# Altium schematic sheet Header_and_OnboardConponents.SchDoc
size B; SheetNumber: 4; SheetTotal: 6
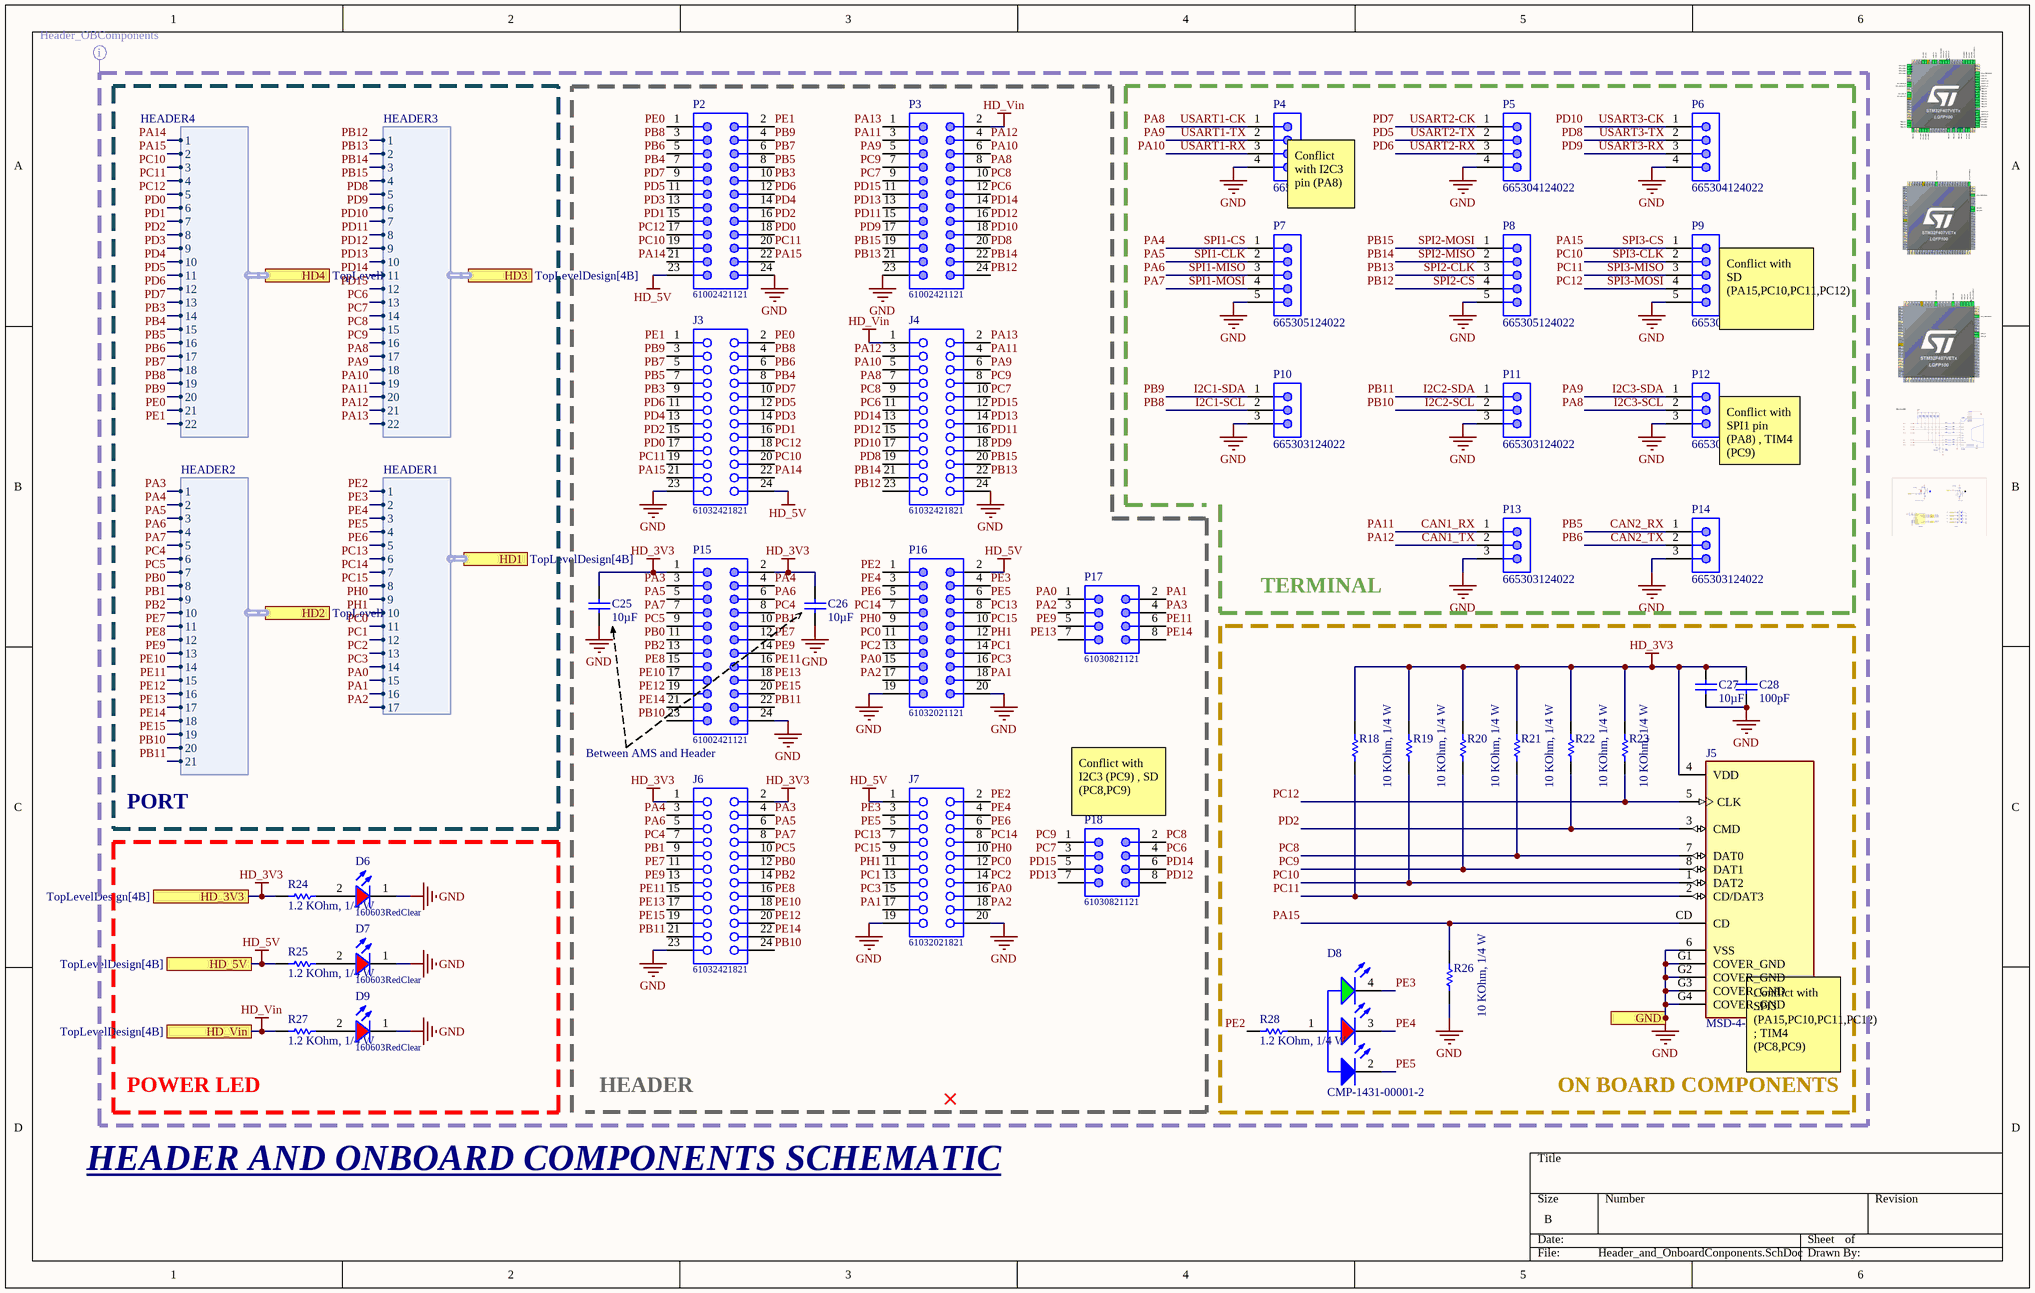
[diagram p0: Header_and_OnboardConponents.SchDoc]

## Parts
C25  value 10µF  [CAP_0603]  (hidden comment: 0106031061010)
C26  value 10µF  [CAP_0603]  (hidden comment: 0106031061010)
C27  value 10µF  [CAP_0603]  (hidden comment: 0106031061010)
C28  value 100pF  [CAP_0603]  (hidden comment: 0106031010550)
D6  160603RedClear  [WL-SMCW_0603_H=0.7mm]
D7  160603RedClear  [WL-SMCW_0603_H=0.7mm]
D8  CMP-1431-00001-2  [WL-SFTW_3528_150141M173100]
D9  160603RedClear  [WL-SMCW_0603_H=0.7mm]
J3  61032421821  [61032421821]
J4  61032421821  [61032421821]
J5  MSD-4-A  [CUI_MSD-4-A]
J6  61032421821  [61032421821]
J7  61032021821  [61032021821]
P2  61002421121  [61002421121]
P3  61002421121  [61002421121]
P4  665304124022  [665304124022]
P5  665304124022  [665304124022]
P6  665304124022  [665304124022]
P7  665305124022  [665305124022]
P8  665305124022  [665305124022]
P9  665305124022  [665305124022]
P10  665303124022  [665303124022]
P11  665303124022  [665303124022]
P12  665303124022  [665303124022]
P13  665303124022  [665303124022]
P14  665303124022  [665303124022]
P15  61002421121  [61002421121]
P16  61032021121  [61032021121]
P17  61030821121  [61030821121]
P18  61030821121  [61030821121]
R18  value 10 KOhm, 1/4 W  [resistor_0603]  (hidden comment: 0006031031)
R19  value 10 KOhm, 1/4 W  [resistor_0603]  (hidden comment: 0006031031)
R20  value 10 KOhm, 1/4 W  [resistor_0603]  (hidden comment: 0006031031)
R21  value 10 KOhm, 1/4 W  [resistor_0603]  (hidden comment: 0006031031)
R22  value 10 KOhm, 1/4 W  [resistor_0603]  (hidden comment: 0006031031)
R23  value 10 KOhm, 1/4 W  [resistor_0603]  (hidden comment: 0006031031)
R24  value 1.2 KOhm, 1/4 W  [resistor_0603]  (hidden comment: 0006031221)
R25  value 1.2 KOhm, 1/4 W  [resistor_0603]  (hidden comment: 0006031221)
R26  value 10 KOhm, 1/4 W  [resistor_0603]  (hidden comment: 0006031031)
R27  value 1.2 KOhm, 1/4 W  [resistor_0603]  (hidden comment: 0006031221)
R28  value 1.2 KOhm, 1/4 W  [resistor_0603]  (hidden comment: 0006031221)

## Blocks framed on the sheet
ON BOARD COMPONENTS: C27 C28 D8 J5 R18-R23 R26 R28
POWER LED: D6 D7 D9 R24 R25 R27

## Ports
GND (see TopLevelDesign[4B], MainMCU[2B], Power[5C], ST-LinkV2[3B]), HD1 (harness HEADER1, see TopLevelDesign[4B]), HD2 (harness HEADER2, see TopLevelDesign[4B]), HD3 (harness HEADER3, see TopLevelDesign[4B]), HD4 (harness HEADER4, see TopLevelDesign[4B]), HD_3V3 (see TopLevelDesign[4B]), HD_5V (see TopLevelDesign[4B]), HD_Vin (see TopLevelDesign[4B])

## Harnesses
HEADER2: 1, 2, 3, 4, 5, 6, 7, 8, 9, 10, 11, 12, 13, 14, 15, 16, 17, 18, 19, 20, 21
HEADER3: 1, 2, 3, 4, 5, 6, 7, 8, 9, 10, 11, 12, 13, 14, 15, 16, 17, 18, 19, 20, 21, 22
HEADER4: 1, 2, 3, 4, 5, 6, 7, 8, 9, 10, 11, 12, 13, 14, 15, 16, 17, 18, 19, 20, 21, 22
HEADER1: 1, 2, 3, 4, 5, 6, 7, 8, 9, 10, 11, 12, 13, 14, 15, 16, 17

## Nets
GND: C25.1 C26.1 C27.1 C28.1 D6.1(K) D7.1(K) D9.1(K) J3.23 J4.24 J5.6(VSS) J5.G1(COVER_GND) J5.G2(COVER_GND) J5.G3(COVER_GND) J5.G4(COVER_GND) J6.23 J7.19 J7.20 P2.24 P3.23 P4.4 P5.4 P6.4 P7.5 P8.5 P9.5 P10.3 P11.3 P12.3 P13.3 P14.3 P15.24 P16.19 P16.20 R26.1 ; port GND
HD_3V3: C25.2 C26.2 C27.2 C28.2 J5.4(VDD) J6.1 J6.2 P15.1 P15.2 R18.2 R19.2 R20.2 R21.2 R22.2 R23.2 R24.2 ; port HD_3V3
HD_5V: J3.24 J7.1 P2.23 P16.2 R25.2 ; port HD_5V
HD_Vin: J4.1 P3.2 R27.2 ; port HD_Vin
CAN1_RX: J4.4 P3.3 P13.1 ; port HD3.20  [also labelled PA11]
CAN1_TX: J4.3 P3.4 P13.2 ; port HD3.21  [also labelled PA12]
CAN2_RX: J3.7 P2.8 P14.1 ; port HD4.16  [also labelled PB5]
CAN2_TX: J3.6 P2.5 P14.2 ; port HD4.17  [also labelled PB6]
I2C1-SCL: J3.4 P2.3 P10.2 ; port HD4.19  [also labelled PB8]
I2C1-SDA: J3.3 P2.4 P10.1 ; port HD4.20  [also labelled PB9]
I2C2-SCL: J6.24 P11.2 P15.23 ; port HD2.20  [also labelled PB10]
I2C2-SDA: J6.21 P11.1 P15.22 ; port HD2.21  [also labelled PB11]
I2C3-SCL: J4.7 P3.8 P4.1 P12.2 ; port HD3.17  [also labelled PA8, USART1-CK]
I2C3-SDA: J4.6 P3.5 P4.2 P12.1 ; port HD3.18  [also labelled PA9, USART1-TX]
PA0: J7.16 P16.15 P17.1 ; port HD1.15
PA1: J7.17 P16.18 P17.2 ; port HD1.16
PA2: J7.18 P16.17 P17.3 ; port HD1.17
PA3: J6.4 P15.3 P17.4 ; port HD2.1
PA4: J6.3 P7.1 P15.4 ; port HD2.2  [also labelled SPI1-CS]
PA5: J6.6 P7.2 P15.5 ; port HD2.3  [also labelled SPI1-CLK]
PA6: J6.5 P7.3 P15.6 ; port HD2.4  [also labelled SPI1-MISO]
PA7: J6.8 P7.4 P15.7 ; port HD2.5  [also labelled SPI1-MOSI]
PA10: J4.5 P3.6 P4.3 ; port HD3.19  [also labelled USART1-RX]
PA13: J4.2 P3.1 ; port HD3.22
PA14: J3.22 P2.21 ; port HD4.1
PA15: J3.21 J5.CD P2.22 P9.1 R26.2 ; port HD4.2  [also labelled SPI3-CS]
PB0: J6.12 P15.11 ; port HD2.8
PB1: J6.9 P15.10 ; port HD2.9
PB2: J6.14 P15.13 ; port HD2.10
PB3: J3.9 P2.10 ; port HD4.14
PB4: J3.8 P2.7 ; port HD4.15
PB7: J3.5 P2.6 ; port HD4.18
PB12: J4.23 P3.24 P8.4 ; port HD3.1  [also labelled SPI2-CS]
PB13: J4.22 P3.21 P8.3 ; port HD3.2  [also labelled SPI2-CLK]
PB14: J4.21 P3.22 P8.2 ; port HD3.3  [also labelled SPI2-MISO]
PB15: J4.20 P3.19 P8.1 ; port HD3.4  [also labelled SPI2-MOSI]
PC0: J7.12 P16.11 ; port HD1.11
PC1: J7.13 P16.14 ; port HD1.12
PC2: J7.14 P16.13 ; port HD1.13
PC3: J7.15 P16.16 ; port HD1.14
PC4: J6.7 P15.8 ; port HD2.6
PC5: J6.10 P15.9 ; port HD2.7
PC6: J4.11 P3.12 P18.4 ; port HD3.13
PC7: J4.10 P3.9 P18.3 ; port HD3.14
PC8: J4.9 J5.7(DAT0) P3.10 P18.2 R21.1 ; port HD3.15
PC9: J4.8 J5.8(DAT1) P3.7 P18.1 R20.1 ; port HD3.16
PC10: J3.20 J5.1(DAT2) P2.19 P9.2 R19.1 ; port HD4.3  [also labelled SPI3-CLK]
PC11: J3.19 J5.2(CD/DAT3) P2.20 P9.3 R18.1 ; port HD4.4  [also labelled SPI3-MISO]
PC12: J3.18 J5.5(CLK) P2.17 P9.4 R23.1 ; port HD4.5  [also labelled SPI3-MOSI]
PC13: J7.7 P16.8 ; port HD1.6
PC14: J7.8 P16.7 ; port HD1.7
PC15: J7.9 P16.10 ; port HD1.8
PD0: J3.17 P2.18 ; port HD4.6
PD1: J3.16 P2.15 ; port HD4.7
PD2: J3.15 J5.3(CMD) P2.16 R22.1 ; port HD4.8
PD3: J3.14 P2.13 ; port HD4.9
PD4: J3.13 P2.14 ; port HD4.10
PD5: J3.12 P2.11 P5.2 ; port HD4.11  [also labelled USART2-TX]
PD6: J3.11 P2.12 P5.3 ; port HD4.12  [also labelled USART2-RX]
PD7: J3.10 P2.9 P5.1 ; port HD4.13  [also labelled USART2-CK]
PD8: J4.19 P3.20 P6.2 ; port HD3.5  [also labelled USART3-TX]
PD9: J4.18 P3.17 P6.3 ; port HD3.6  [also labelled USART3-RX]
PD10: J4.17 P3.18 P6.1 ; port HD3.7  [also labelled USART3-CK]
PD11: J4.16 P3.15 ; port HD3.8
PD12: J4.15 P3.16 P18.8 ; port HD3.9
PD13: J4.14 P3.13 P18.7 ; port HD3.10
PD14: J4.13 P3.14 P18.6 ; port HD3.11
PD15: J4.12 P3.11 P18.5 ; port HD3.12
PE0: J3.2 P2.1 ; port HD4.21
PE1: J3.1 P2.2 ; port HD4.22
PE2: J7.2 P16.1 R28.1 ; port HD1.1
PE3: D8.4(K) J7.3 P16.4 ; port HD1.2
PE4: D8.3(K) J7.4 P16.3 ; port HD1.3
PE5: D8.2(K) J7.5 P16.6 ; port HD1.4
PE6: J7.6 P16.5 ; port HD1.5
PE7: J6.11 P15.12 ; port HD2.11
PE8: J6.16 P15.15 ; port HD2.12
PE9: J6.13 P15.14 P17.5 ; port HD2.13
PE10: J6.18 P15.17 ; port HD2.14
PE11: J6.15 P15.16 P17.6 ; port HD2.15
PE12: J6.20 P15.19 ; port HD2.16
PE13: J6.17 P15.18 P17.7 ; port HD2.17
PE14: J6.22 P15.21 P17.8 ; port HD2.18
PE15: J6.19 P15.20 ; port HD2.19
PH0: J7.10 P16.9 ; port HD1.9
PH1: J7.11 P16.12 ; port HD1.10
NetD6_2: D6.2(A) R24.1
NetD7_2: D7.2(A) R25.1
NetD8_1: D8.1(A) R28.2
NetD9_2: D9.2(A) R27.1

## Layout directives
mark named Header_OBComponents: CAN1_RX, CAN1_TX, CAN2_RX, CAN2_TX, GND, HD_3V3, HD_5V, HD_Vin, I2C1-SCL, I2C1-SDA, I2C2-SCL, I2C2-SDA, I2C3-SCL, I2C3-SDA, PA0, PA1, PA2, PA3, PA4, PA5, PA6, PA7, PA8, PA9, PA10, PA11, PA12, PA13, PA14, PA15, PB0, PB1, PB2, PB3, PB4, PB5, PB6, PB7, PB8, PB9, PB10, PB11, PB12, PB13, PB14, PB15, PC0, PC1, PC2, PC3, PC4, PC5, PC6, PC7, PC8, PC9, PC10, PC11, PC12, PC13, PC14, PC15, PD0, PD1, PD2, PD3, PD4, PD5, PD6, PD7, PD8, PD9, PD10, PD11, PD12, PD13, PD14, PD15, PE0, PE1, PE2, PE3, PE4, PE5, PE6, PE7, PE8, PE9, PE10, PE11, PE12, PE13, PE14, PE15, PH0, PH1, SPI1-CLK, SPI1-CS, SPI1-MISO, SPI1-MOSI, SPI2-CLK, SPI2-CS, SPI2-MISO, SPI2-MOSI, SPI3-CLK, SPI3-CS, SPI3-MISO, SPI3-MOSI, USART1-CK, USART1-RX, USART1-TX, USART2-CK, USART2-RX, USART2-TX, USART3-CK, USART3-RX, USART3-TX

## Notes on the sheet
- (near P4) Conflict with I2C3 pin (PA8)
- (near P9) Conflict with SD (PA15,PC10,PC11,PC12)
- (near P12) Conflict with SPI1 pin (PA8) , TIM4 (PC9)
- TERMINAL
- Between AMS and Header
- PORT
- (near P18) Conflict with I2C3 (PC9) , SD (PC8,PC9)
- HEADER
- (near J5) Conflict with SPI3 (PA15,PC10,PC11,PC12) ; TIM4 (PC8,PC9)
- HEADER AND ONBOARD COMPONENTS SCHEMATIC

## Library data of the parts
C25-C27 = CMP-001-00219-1: CAP, size 0603, 10 uF, 10 VDC; Manufacture Name: Samsung Electro-Mechanics; Manufacture SN: CL10A106KP8NNWC; Voltage Rating DC: 10 VDC; Tolerance: 10%; Supplier 3 Name: thegioiic; Supplier 2 Name: Digi-Key; Design Item ID: 0106031061010; Size: 0603; Packaging: Tape and Reel; Supplier 1 URL: https://www.mouser.vn/ProductDetail/Samsung-Electro-Mechanics/CL10A106KP8NNWC?qs=xZ%2FP%252Ba9zWqZx8LSX23YqWA%3D%3D&utm_source=mouser-refine-download&utm_medium=file&utm_campaign=CL10A106KP8NNWC&utm_content=Samsung-Electro-Mechanics; Supplier 3 SN: N/A; Component Type: Standard; Supplier 2 SN: 1276-CL10A106KP8NNWCTR-ND; Supplier 1 Name: Mouser; Supplier 2 URL: https://www.digikey.com/en/products/detail/samsung-electro-mechanics/cl10a106kp8nnwc/16572907; Source: Capacitor_0603_10_percent.SchLib; Supplier 3 URL: https://www.thegioiic.com/tu-gom-0603-10uf-25v; Pins: 2; Supplier 1 SN: 187-CL10A106KP8NNWC; Operating Temperature: -55 to +125degC; Mounting Technology: SMT
C28 = CMP-001-00209-1: CAP, size 0603, 100 pF, 50 VDC; Manufacture Name: TDK; Manufacture SN: CGA3E2C0G1H101J080AA; Voltage Rating DC: 50 VDC; Tolerance: 5%; Packaging: Tape and Reel; Supplier 3 SN: N/A; Source: Capacitor_0603_5_percent.SchLib; Supplier 1 URL: https://www.mouser.com/ProductDetail/TDK/CGA3E2C0G1H101J080AA?qs=FxQuwy19cyBF0gUakpLdHA%3D%3D&utm_source=mouser-refine-download&utm_medium=file&utm_campaign=CGA3E2C0G1H101J080AA&utm_content=TDK; Supplier 3 URL: N/A; Supplier 2 URL: https://www.digikey.com/en/products/detail/tdk-corporation/cga3e2c0g1h101j080aa/2443118; Supplier 2 Name: Digi-Key; Supplier 1 SN: 810-CGA3E2C0G1H101J; Mounting Technology: SMT; Size: 0603; Design Item ID: 0106031010550; Supplier 1 Name: Mouser; Component Type: Standard; Operating Temperature: -55 to +125degC; Supplier 3 Name: thegioiic; Pins: 2; Supplier 2 SN: 445-5640-2-ND
D6 D7 D9 = CMP-004-00094-1: WL-SMCW SMT Mono-color Chip LED Waterclear, size 0603, Red, 2V, 140deg; Type: Clear; Value: Red, 2V; ComponentLink4URL: https://www.thegioiic.com/led-do-0603-dan-smd-trong-suot; Supplier 3 URL: https://www.thegioiic.com/led-do-0603-dan-smd-trong-suot; ComponentLink3URL: https://www.digikey.com/en/products/detail/liteon/LTST-C191KRKT/386837; Component Type: Standard; ComponentLink4Description: Supplier 3 URL; Supplier 3 SN: N/A; Pins: 2; Size: 0603; Supplier 2 URL: https://www.digikey.com/en/products/detail/liteon/LTST-C191KRKT/386837; ComponentLink2Description: Supplier 1 URL; Color: Red; Supplier 1 URL: https://www.mouser.vn/ProductDetail/Wurth-Elektronik/150060RS75000?qs=LlUlMxKIyB3QnmZ3fw%2FVCA%3D%3D; Supplier 2 Name: Digi-Key; ComponentLink2URL: https://www.mouser.vn/ProductDetail/Wurth-Elektronik/150060RS75000?qs=LlUlMxKIyB3QnmZ3fw%2FVCA%3D%3D; Supplier 2 SN: 160-1447-2-ND; ComponentLink3Description: Supplier 2 URL; Supplier 1 SN: 710-150060RS75000; Source: WL-SMCW_0603.SchLib; Supplier 3 Name: ICDayRoi; ComponentLink1URL: N/A; Supplier 1 Name: Mouser; ComponentLink1Description: Datasheet link; Design Item ID: 160603RedClear
D8 = CMP-004-00112-1: NexarPartId: 29717795; Viewing Angle: 120°; Color: Green, Red; Forward Current: 100mA; Test Current: 20mA; Lens Style: Clear, Round; Luminous Intensity: 230mcd; Dominant Wavelength: 520nm; Power Dissipation: 72mW; Max Reverse Voltage (DC): 5V; Peak Wavelength: 465nm; Forward Voltage: 3.2V; Wavelength: 470nm; Min Operating Temperature: -40°C; Case/Package: 1411; Pin Count: 4; Component Type: Standard; RoHS: Compliant; Width: 2.8mm; Length: 3.5mm; Mount: Surface Mount; Packaging: Tape and Reel; Max Operating Temperature: 85°C; Height: 1.9mm; Design Item ID: CMP-1431-00001-2; Source: rgb.SchLib; REACH SVHC: Unknown; Pins: 4; Case Code (Metric): 3528
J3 J4 J6 = CMP-002-00462-1: WR-PHD Socket Header, SMT, pitch 2.54mm, Dual Row, Vertical, 24p; Manufacturer: Wurth Elektronik; Pin Number: 24; Contact Resistance: 20mOhm; Rated Current: 3A; Working Voltage: 250VAC; Withstanding Voltage: 600VAC; Packaging: Tape and Reel; Supplier 3 Name: thegioiic; Operating Temperature: -40 to +105degC; Pitch: 2.54mm; Row Number: Dual; Orientation: Vertical; ComponentLink2URL: https://www.we-online.com/catalog/datasheet/61032421821.pdf; Mounting Technology: SMT; Component Type: Standard; Supplier 1 URL: https://www.mouser.vn/ProductDetail/Wurth-Elektronik/61032421821?qs=Cb2nCFKsA8olwuXV8WYPMw%3D%3D; Supplier 1 Name: Mouser; Pins: 24; Published Date: May 2020; ComponentLink1Description: Manufacturer; Supplier 2 Name: Digi-Key; Supplier 3 SN: N/A; ComponentLink4Description: Global Supply; ComponentLink2Description: Datasheet; Source: WR-PHD_Socket Header_2.54mm.SchLib; ComponentLink3URL: https://www.we-online.com/en/components/products/PHD_2_54_SMT_DUAL_SOCKET_HEADER_6100XX21821?sq=61032421821#61032421821; ComponentLink1URL: http://www.we-online.de; Supplier 2 URL: N/A; Gender: Socket Header; Manufacturer Part Number: 61032421821; Design Item ID: 61032421821; ComponentLink4URL: https://www.mouser.vn/ProductDetail/Wurth-Elektronik/61032421821?qs=Cb2nCFKsA8olwuXV8WYPMw%3D%3D; Supplier 2 SN: N/A; Supplier 3 URL: N/A; ComponentLink3Description: Global Supply; Supplier 1 SN: 710-61032421821
J5 = CMP-002-01571-2: Micro SD Card Connector, 9 Positions, Connector and Ejector, Push In, Auto Eject Out, Surface Mount, 1.8 mm Height Above Board, Gold Flash; MF: CUI Devices; Case/Package: None; CUI_purchase_URL: https://www.cuidevices.com/product/interconnect/connectors/memory-card-connectors/sd-card-connectors/msd-4-a?utm_source=snapeda.com&utm_medium=referral&utm_campaign=snapedaBOM; Source: MSD-4-A.SchLib; SnapEDA_Link: https://www.snapeda.com/parts/MSD-4-A/CUI+Devices/view-part/?ref=snap; Component Type: Standard; Pins: 13; Design Item ID: MSD-4-A; MP: MSD-4-A; Check_prices: https://www.snapeda.com/parts/MSD-4-A/CUI+Devices/view-part/?ref=eda; Value: *
J7 = CMP-002-00459-1: WR-PHD Socket Header, SMT, pitch 2.54mm, Dual Row, Vertical, 20p; Manufacturer: Wurth Elektronik; Working Voltage: 250VAC; Pin Number: 20; Withstanding Voltage: 600VAC; Contact Resistance: 20mOhm; Rated Current: 3A; ComponentLink1URL: http://www.we-online.de; ComponentLink4URL: https://www.mouser.vn/ProductDetail/Wurth-Elektronik/61032021821?qs=Cb2nCFKsA8rLJ0ZbRtJw1w%3D%3D; Operating Temperature: -40 to +105degC; ComponentLink3URL: https://www.we-online.com/en/components/products/PHD_2_54_SMT_DUAL_SOCKET_HEADER_6100XX21821?sq=61032021821#61032021821; Orientation: Vertical; ComponentLink2Description: Datasheet; Supplier 1 SN: 710-61032021821; ComponentLink2URL: https://www.we-online.com/catalog/datasheet/61032021821.pdf; Row Number: Dual; Packaging: Tape and Reel; Supplier 1 URL: https://www.mouser.vn/ProductDetail/Wurth-Elektronik/61032021821?qs=Cb2nCFKsA8rLJ0ZbRtJw1w%3D%3D; Supplier 2 URL: N/A; Source: WR-PHD_Socket Header_2.54mm.SchLib; ComponentLink1Description: Manufacturer; Manufacturer Part Number: 61032021821; ComponentLink3Description: Global Supply; Component Type: Standard; Supplier 1 Name: Mouser; Gender: Socket Header; Supplier 3 Name: thegioiic; Supplier 3 URL: N/A; Mounting Technology: SMT; Supplier 3 SN: N/A; Pitch: 2.54mm; Pins: 20; Supplier 2 Name: Digi-Key; ComponentLink4Description: Global Supply; Supplier 2 SN: N/A; Published Date: May 2020; Design Item ID: 61032021821
P2 P3 P15 = CMP-002-00395-1: WR-PHD Pin Header, SMT, pitch 2.54mm, Dual Row, Vertical, 24p; Manufacturer: Wurth Elektronik; Withstanding Voltage: 500VAC; Pin Number: 24; Rated Current: 3A; Working Voltage: 250VAC; Supply name 1: Mouser; Contact Resistance: 20mOhm; Supplier 1 SN: 710-61002421121; Supplier 3 URL: N/A; ComponentLink3Description: Global Supply; Orientation: Vertical; Packaging: Tube; Published Date: May 2020; Pins: 24; Supplier 2 SN: N/A; Component Type: Standard; Source: WR-PHD_Pin Header_2.54mm.SchLib; Supplier 3 Name: thegioiic; Design Item ID: 61002421121; Mounting Technology: SMT; ComponentLink4Description: Global Supply; Row Number: Dual; ComponentLink1URL: http://www.we-online.de; ComponentLink2URL: https://www.we-online.com/catalog/datasheet/61002421121.pdf; ComponentLink2Description: Datasheet; ComponentLink4URL: https://www.mouser.vn/ProductDetail/Wurth-Elektronik/61002421121?qs=PhR8RmCirEaUrVIpVd3oMg%3D%3D; Supplier 1 Name: Mouser; Gender: Pin Header; Supplier 2 URL: N/A; ComponentLink3URL: https://www.we-online.com/en/components/products/PHD_2_54_SMT_DUAL_PIN_HEADER_6100XX21121?sq=61002421121#61002421121; Pitch: 2.54mm; ComponentLink1Description: Manufacturer; Supplier 1 URL: https://www.mouser.vn/ProductDetail/Wurth-Elektronik/61002421121?qs=PhR8RmCirEaUrVIpVd3oMg%3D%3D; Operating Temperature: -40 to +125degC; Supplier 3 SN: N/A; Supplier 2 Name: Digi-Key; Manufacturer Part Number: 61002421121
P4-P6 = CMP-002-01224-1: WR-WTB SMT Male Vertical Shrouded Header, pitch 1mm, 4p; Rated Current: 1A; Value: 1A, 125 V (AC); Contact Resistance: 20mOhm; Working Voltage: 50VAC; Withstanding Voltage: 500VAC; Pin Number: 4; Mounting Technology: SMT; Supplier 3 Name: thegioiic; Supplier 2 URL: N/A; Supplier 3 URL: N/A; Packaging: Tape and Reel; Gender: Male; ComponentLink4URL: https://www.mouser.vn/ProductDetail/Wurth-Elektronik/665304124022?qs=a9WhcLg8qCx8aEna1KcTfg%3D%3D; Source: WR-WTB_1.00mm.SchLib; ComponentLink3Description: Global Supply; Supplier 3 SN: N/A; ComponentLink4Description: Global Supply; ComponentLink2URL: https://www.we-online.com/catalog/datasheet/665304124022.pdf; Component Type: Standard; Type: Vertical; ComponentLink1URL: http://www.we-online.de; Pins: 4; Publisher: Wurth Elektronik; Supplier 1 SN: 710-665304124022; ComponentLink2Description: Datasheet; Supplier 2 Name: Digi-Key; ComponentLink1Description: Manufacturer; Operating Temperature: -25 to +85degC; ComponentLink3URL: https://www.we-online.com/en/components/products/WTB_1_00_SMT_MALE_VERTICAL_SHROUDED_HEADER_6653XX124022?sq=665304124022#665304124022; Published Date: January 2020; Supplier 1 URL: https://www.mouser.vn/ProductDetail/Wurth-Elektronik/665304124022?qs=a9WhcLg8qCx8aEna1KcTfg%3D%3D; Supplier 2 SN: N/A; Supplier 1 Name: Mouser; Design Item ID: 665304124022; Pitch: 1mm; Part Number: 665304124022
P7-P9 = CMP-002-01225-1: WR-WTB SMT Male Vertical Shrouded Header, pitch 1mm, 5p; Working Voltage: 50VAC; Rated Current: 1A; Contact Resistance: 20mOhm; Value: 1A, 125 V (AC); Pin Number: 5; Withstanding Voltage: 500VAC; Publisher: Wurth Elektronik; Component Type: Standard; Supplier 1 Name: Mouser; Operating Temperature: -25 to +85degC; Supplier 3 Name: thegioiic; ComponentLink1URL: http://www.we-online.de; ComponentLink4URL: https://www.mouser.vn/ProductDetail/Wurth-Elektronik/665305124022?qs=a9WhcLg8qCwo9s3v61a5IA%3D%3D; Design Item ID: 665305124022; Part Number: 665305124022; Packaging: Tape and Reel; ComponentLink3URL: https://www.we-online.com/en/components/products/WTB_1_00_SMT_MALE_VERTICAL_SHROUDED_HEADER_6653XX124022?sq=665305124022#665305124022; Supplier 1 SN: 710-665305124022; Supplier 2 URL: N/A; Supplier 3 URL: N/A; Pitch: 1mm; Gender: Male; Pins: 5; ComponentLink4Description: Global Supply; Supplier 2 SN: N/A; ComponentLink2Description: Datasheet; Supplier 3 SN: N/A; Supplier 2 Name: Digi-Key; Mounting Technology: SMT; Published Date: January 2020; Type: Vertical; ComponentLink2URL: https://www.we-online.com/catalog/datasheet/665305124022.pdf; Source: WR-WTB_1.00mm.SchLib; ComponentLink1Description: Manufacturer; ComponentLink3Description: Global Supply; Supplier 1 URL: https://www.mouser.vn/ProductDetail/Wurth-Elektronik/665305124022?qs=a9WhcLg8qCwo9s3v61a5IA%3D%3D
P10-P14 = CMP-002-01223-1: WR-WTB SMT Male Vertical Shrouded Header, pitch 1mm, 3p; Contact Resistance: 20mOhm; Rated Current: 1A; Withstanding Voltage: 500VAC; Value: 1A, 125 V (AC); Pin Number: 3; Working Voltage: 50VAC; Supplier 1 URL: https://www.mouser.vn/ProductDetail/Wurth-Elektronik/665303124022?qs=a9WhcLg8qCyV5ri9HU4hCQ%3D%3D; ComponentLink2URL: https://www.we-online.com/catalog/datasheet/665303124022.pdf; Packaging: Tape and Reel; Supplier 2 SN: N/A; Source: WR-WTB_1.00mm.SchLib; Publisher: Wurth Elektronik; Supplier 2 Name: Digi-Key; Supplier 3 SN: N/A; Published Date: January 2020; ComponentLink4Description: Global Supply; Mounting Technology: SMT; ComponentLink1Description: Manufacturer; Supplier 3 URL: N/A; Supplier 2 URL: N/A; Operating Temperature: -25 to +85degC; Type: Vertical; ComponentLink3URL: https://www.we-online.com/en/components/products/WTB_1_00_SMT_MALE_VERTICAL_SHROUDED_HEADER_6653XX124022?sq=665303124022#665303124022; Design Item ID: 665303124022; Component Type: Standard; Pitch: 1mm; ComponentLink2Description: Datasheet; Part Number: 665303124022; Gender: Male; Supplier 1 SN: 710-665303124022; Pins: 3; ComponentLink4URL: https://www.mouser.vn/ProductDetail/Wurth-Elektronik/665303124022?qs=a9WhcLg8qCyV5ri9HU4hCQ%3D%3D; Supplier 1 Name: Mouser; Supplier 3 Name: thegioiic; ComponentLink1URL: http://www.we-online.de; ComponentLink3Description: Global Supply
P16 = CMP-002-00458-1: WR-PHD Pin Header, SMT, pitch 2.54mm, Dual Row, Vertical, 20p; Manufacturer: Wurth Elektronik; Withstanding Voltage: 500VAC; Contact Resistance: 20mOhm; Working Voltage: 250VAC; Pin Number: 20; Rated Current: 3A; Supply name 1: Mouser; Supplier 2 Name: Digi-Key; Packaging: Tape and Reel; Mounting Technology: SMT; Supplier 3 SN: N/A; Published Date: May 2020; Pins: 20; Component Type: Standard; ComponentLink3URL: https://www.we-online.com/en/components/products/PHD_2_54_SMT_DUAL_PIN_HEADER_6100XX21121?sq=61032021121#61032021121; Manufacturer Part Number: 61032021121; Pitch: 2.54mm; ComponentLink2URL: https://www.we-online.com/catalog/datasheet/61032021121.pdf; ComponentLink1Description: Manufacturer; Operating Temperature: -40 to +125degC; Source: WR-PHD_Pin Header_2.54mm.SchLib; ComponentLink1URL: http://www.we-online.de; ComponentLink4Description: Global Supply; Supplier 1 SN: 710-61032021121; ComponentLink3Description: Global Supply; Supplier 3 URL: N/A; Supplier 2 SN: N/A; Row Number: Dual; Supplier 3 Name: thegioiic; ComponentLink4URL: https://www.mouser.vn/ProductDetail/Wurth-Elektronik/61032021121?qs=PhR8RmCirEazLxlZVVgCjg%3D%3D; Supplier 1 Name: Mouser; Orientation: Vertical; ComponentLink2Description: Datasheet; Design Item ID: 61032021121; Supplier 1 URL: https://www.mouser.vn/ProductDetail/Wurth-Elektronik/61032021121?qs=PhR8RmCirEazLxlZVVgCjg%3D%3D; Gender: Pin Header; Supplier 2 URL: N/A
P17 P18 = CMP-002-00442-1: WR-PHD Pin Header, SMT, pitch 2.54mm, Dual Row, Vertical, 8p; Manufacturer: Wurth Elektronik; Withstanding Voltage: 500VAC; Working Voltage: 250VAC; Contact Resistance: 20mOhm; Pin Number: 8; Rated Current: 3A; Supply name 1: Mouser; Supplier 3 SN: N/A; ComponentLink4URL: https://www.mouser.vn/ProductDetail/Wurth-Elektronik/61030821121?qs=PhR8RmCirEbjbnJ8oQ44mA%3D%3D; ComponentLink1URL: http://www.we-online.de; Pitch: 2.54mm; ComponentLink3URL: https://www.we-online.com/en/components/products/PHD_2_54_SMT_DUAL_PIN_HEADER_6100XX21121?sq=61030821121#61030821121; Source: WR-PHD_Pin Header_2.54mm.SchLib; Supplier 2 Name: Digi-Key; ComponentLink4Description: Global Supply; Component Type: Standard; ComponentLink1Description: Manufacturer; Supplier 3 Name: thegioiic; Supplier 3 URL: N/A; ComponentLink2Description: Datasheet; Design Item ID: 61030821121; Mounting Technology: SMT; ComponentLink2URL: https://www.we-online.com/catalog/datasheet/61030821121.pdf; Orientation: Vertical; Supplier 2 SN: N/A; Supplier 1 Name: Mouser; Supplier 1 URL: https://www.mouser.vn/ProductDetail/Wurth-Elektronik/61030821121?qs=PhR8RmCirEbjbnJ8oQ44mA%3D%3D; Manufacturer Part Number: 61030821121; Published Date: May 2020; Row Number: Dual; Gender: Pin Header; ComponentLink3Description: Global Supply; Supplier 2 URL: N/A; Pins: 8; Operating Temperature: -40 to +125degC; Supplier 1 SN: 710-61030821121; Packaging: Tape and Reel
R18-R23 R26 = CMP-009-00188-1: RES, size 0603, 10 KOhm, 1/4 W; Manufacture  Name: OEM; Rated Power: 1/4 W; Resistance Tolerance: +/-1%; ComponentLink1Description: Datasheet link; Size: 0603; Supplier 2 SN: RHM10KADTR-ND RHM10KADCT-ND RHM10KADDKR-ND; Mounting Technology: SMT; ComponentLink2URL: N/A; Design Item ID: 0006031031; Supplier 1 Name: Mouser; Component Type: Standard; Supplier 2 URL: https://www.digikey.com/en/products/detail/rohm-semiconductor/ESR03EZPF1002/1983429; Manufacture  SN: OEM; Supplier 2 Name: Digi-Key; Supplier 3 URL: N/A; Source: Resistor_0603.SchLib; ComponentLink1URL: https://fscdn.rohm.com/en/products/databook/datasheet/passive/resistor/chip_resistor/esr-e.pdf; Pins: 2; ComponentLink3Description: Supplier 2 URL; Supplier 1 URL: https://www.mouser.vn/ProductDetail/ROHM-Semiconductor/ESR03EZPF1002?qs=sGAEpiMZZMvdGkrng054t67Efho1F8r6CDeAsqwFse8%3D; Supplier 1 SN: 755-ESR03EZPF1002; Supplier 3 SN: N/A; ComponentLink3URL: https://www.digikey.com/en/products/detail/rohm-semiconductor/ESR03EZPF1002/1983429; ComponentLink4Description: Supplier 3 URL; Supplier 3 Name: thegioiic; ComponentLink2Description: Supplier 1 URL; ComponentLink4URL: N/A
R24 R25 R27 R28 = CMP-009-00209-1: RES, size 0603, 1.2 KOhm, 1/4 W; Manufacture  Name: OEM; Rated Power: 1/4 W; Resistance Tolerance: +/-1%; ComponentLink2URL: N/A; ComponentLink4URL: N/A; ComponentLink2Description: Supplier 1 URL; Design Item ID: 0006031221; ComponentLink1Description: Datasheet link; Pins: 2; Supplier 1 SN: 667-ERJ-UP3F1201V; Supplier 1 URL: https://www.mouser.vn/ProductDetail/Panasonic/ERJ-UP3F1201V?qs=sGAEpiMZZMvdGkrng054twq3eZrCFN895BO3G72d%2F02jECAea43bgQ%3D%3D; Supplier 3 URL: N/A; Source: Resistor_0603.SchLib; ComponentLink1URL: https://api.pim.na.industrial.panasonic.com/file_stream/main/fileversion/4484; Supplier 3 Name: thegioiic; Supplier 2 Name: Digi-Key; ComponentLink3Description: Supplier 2 URL; Component Type: Standard; Mounting Technology: SMT; ComponentLink4Description: Supplier 3 URL; Supplier 1 Name: Mouser; ComponentLink3URL: N/A; Manufacture  SN: OEM; Supplier 2 URL: N/A; Size: 0603; Supplier 3 SN: N/A; Supplier 2 SN: 10-ERJ-UP3F1201VTR-ND 10-ERJ-UP3F1201VCT-ND 10-ERJ-UP3F1201VDKR-ND